# Altium schematic sheet 24.064.SchDoc
size A4
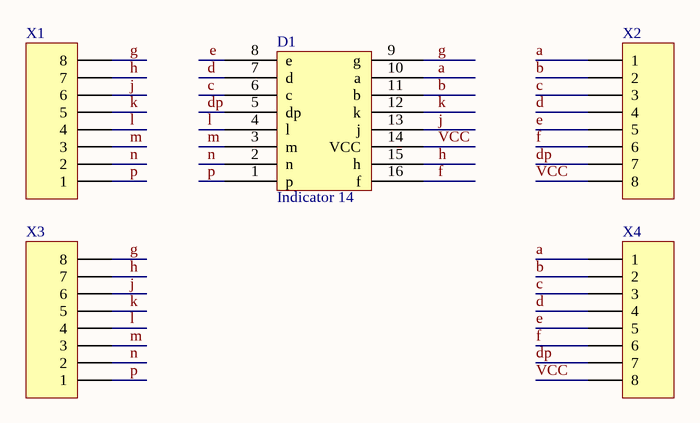
[diagram p0: 24.064.SchDoc]

## Parts
D1  Indicator 14  [INDICATIR 14]
X1  Header 8  [HDR1X8]  (value not drawn)
X2  Header 8  [HDR1X8]  (value not drawn)
X3  Header 8  [HDR1X8]  (value not drawn)
X4  Header 8  [HDR1X8]  (value not drawn)

## Nets
a: D1.10(a) X2.1 X4.1
b: D1.11(b) X2.2 X4.2
c: D1.6(c) X2.3 X4.3
d: D1.7(d) X2.4 X4.4
dp: D1.5(dp) X2.7 X4.7
e: D1.8(e) X2.5 X4.5
f: D1.16(f) X2.6 X4.6
g: D1.9(g) X1.8 X3.8
h: D1.15(h) X1.7 X3.7
j: D1.13(j) X1.6 X3.6
k: D1.12(k) X1.5 X3.5
l: D1.4(l) X1.4 X3.4
m: D1.3(m) X1.3 X3.3
n: D1.2(n) X1.2 X3.2
p: D1.1(p) X1.1 X3.1
VCC: D1.14(VCC) X2.8 X4.8

## Library data of the parts
X1-X4 = Header 8: Header, 8-Pin; LatestRevisionDate: 17-Jul-2002; LatestRevisionNote: Re-released for DXP Platform.; Publisher: Altium Limited